# Altium schematic sheet ChangingMelodiesShield.SchDoc
size A4
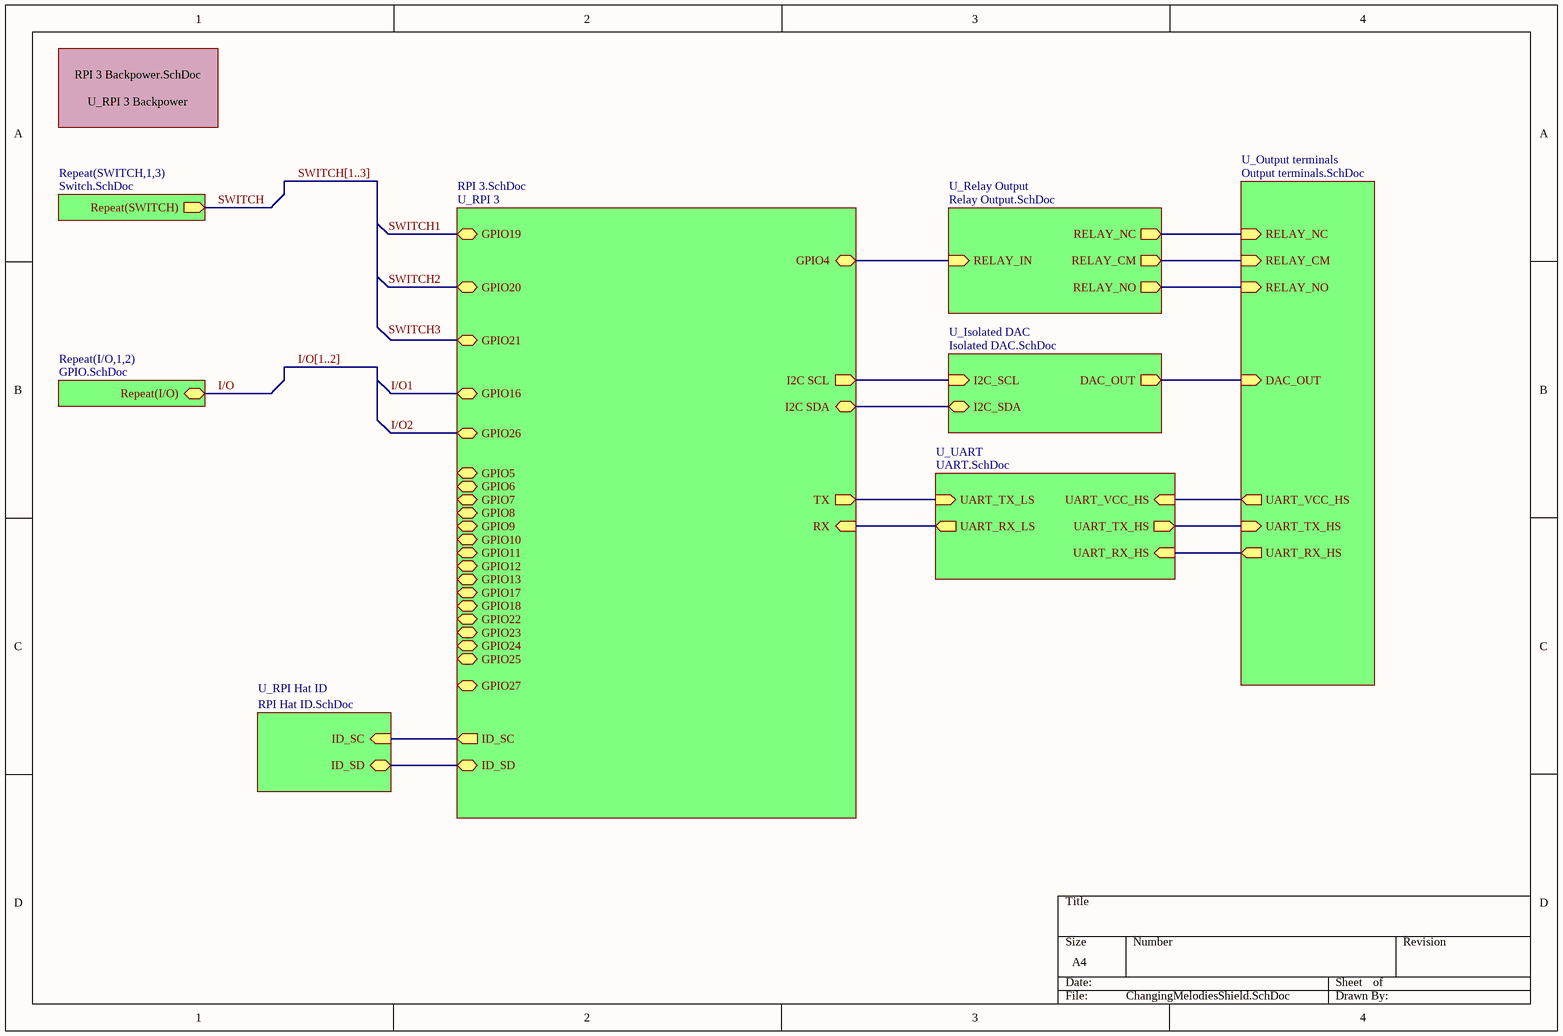
[diagram p0: ChangingMelodiesShield.SchDoc]

## Sub-sheets
Repeat(I/O,1,2) = GPIO.SchDoc: Repeat(I/O) (bidir)
Repeat(SWITCH,1,3) = Switch.SchDoc: Repeat(SWITCH) (out)
U_Isolated DAC = Isolated DAC.SchDoc: I2C_SCL (in), I2C_SDA (bidir), DAC_OUT (out)
U_Output terminals = Output terminals.SchDoc: DAC_OUT (in), RELAY_NO (in), RELAY_NC (in), RELAY_CM (in), UART_RX_HS (out), UART_VCC_HS (out), UART_TX_HS (in)
U_Relay Output = Relay Output.SchDoc: RELAY_IN (in), RELAY_NC (out), RELAY_NO (out), RELAY_CM (out)
U_RPI 3 = RPI 3.SchDoc: I2C SDA (bidir), I2C SCL (out), GPIO4 (bidir), GPIO17 (bidir), GPIO27 (bidir), GPIO22 (bidir), GPIO26 (bidir), GPIO19 (bidir), GPIO6 (bidir), GPIO5 (bidir), RX (in), TX (out), GPIO24 (bidir), GPIO25 (bidir), GPIO12 (bidir), GPIO18 (bidir), GPIO23 (bidir), ID_SD (bidir), GPIO13 (bidir), GPIO16 (bidir), GPIO8 (bidir), ID_SC (out), GPIO21 (bidir), GPIO7 (bidir), GPIO20 (bidir), GPIO11 (bidir), GPIO9 (bidir), GPIO10 (bidir)
U_RPI 3 Backpower = RPI 3 Backpower.SchDoc: no entries
U_RPI Hat ID = RPI Hat ID.SchDoc: ID_SD (bidir), ID_SC (in)
U_UART = UART.SchDoc: UART_RX_LS (out), UART_TX_LS (in), UART_RX_HS (in), UART_TX_HS (out), UART_VCC_HS (in)

## Nets
I/O: sheet Repeat(I/O,1,2)/Repeat(I/O)
I/O1: sheet U_RPI 3/GPIO16
I/O2: sheet U_RPI 3/GPIO26
SWITCH: sheet Repeat(SWITCH,1,3)/Repeat(SWITCH)
SWITCH1: sheet U_RPI 3/GPIO19
SWITCH2: sheet U_RPI 3/GPIO20
SWITCH3: sheet U_RPI 3/GPIO21
(unnamed): sheet U_RPI 3/I2C SDA, sheet U_Isolated DAC/I2C_SDA
(unnamed): sheet U_RPI 3/I2C SCL, sheet U_Isolated DAC/I2C_SCL
(unnamed): sheet U_RPI 3/GPIO4, sheet U_Relay Output/RELAY_IN
(unnamed): sheet U_RPI 3/RX, sheet U_UART/UART_RX_LS
(unnamed): sheet U_RPI 3/TX, sheet U_UART/UART_TX_LS
(unnamed): sheet U_RPI 3/ID_SD, sheet U_RPI Hat ID/ID_SD
(unnamed): sheet U_RPI 3/ID_SC, sheet U_RPI Hat ID/ID_SC
(unnamed): sheet U_Isolated DAC/DAC_OUT, sheet U_Output terminals/DAC_OUT
(unnamed): sheet U_Output terminals/RELAY_NO, sheet U_Relay Output/RELAY_NO
(unnamed): sheet U_Output terminals/RELAY_NC, sheet U_Relay Output/RELAY_NC
(unnamed): sheet U_Output terminals/RELAY_CM, sheet U_Relay Output/RELAY_CM
(unnamed): sheet U_Output terminals/UART_RX_HS, sheet U_UART/UART_RX_HS
(unnamed): sheet U_Output terminals/UART_VCC_HS, sheet U_UART/UART_VCC_HS
(unnamed): sheet U_Output terminals/UART_TX_HS, sheet U_UART/UART_TX_HS

## Buses and harness runs
bus I/O[1..2]
bus SWITCH[1..3]